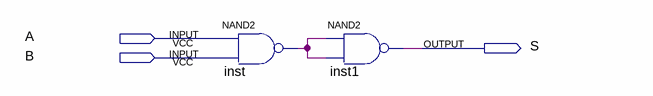
[diagram p0: schematic sheet]
// Quartus schematic nand_and.bdf as structural Verilog: 2 symbols, 3 pins
module nand_and (
  input  A,
  input  B,
  output S
);

  wire inst_out;

  nand inst (inst_out, A, B);
  nand inst1 (S, inst_out, inst_out);
endmodule
